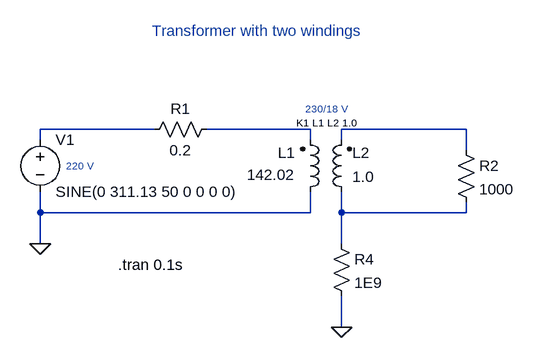
[diagram p0: schematic transformer.asc]
transformer.asc, the LTspice schematic file:
Version 4
SHEET 1 880 680
WIRE -128 176 -304 176
WIRE 112 176 -48 176
WIRE 352 176 160 176
WIRE -304 192 -304 176
WIRE 112 192 112 176
WIRE 160 192 160 176
WIRE 352 208 352 176
WIRE -304 304 -304 272
WIRE 112 304 112 272
WIRE 112 304 -304 304
WIRE 160 304 160 272
WIRE 352 304 352 288
WIRE 352 304 160 304
WIRE -304 352 -304 304
WIRE 160 352 160 304
WIRE 160 480 160 432
FLAG 160 480 0
FLAG -304 352 0
SYMBOL ind2 96 288 M180
WINDOW 0 -7 76 Right 2
WINDOW 3 -7 42 Right 2
SYMATTR InstName L1
SYMATTR Value 142.02
SYMATTR Type ind
SYMBOL voltage -304 176 R0
WINDOW 123 0 0 Left 2
WINDOW 39 0 0 Left 2
SYMATTR InstName V1
SYMATTR Value SINE(0 311.13 50 0 0 0 0)
SYMBOL res -32 160 R90
WINDOW 0 0 56 VBottom 2
WINDOW 3 32 56 VTop 2
SYMATTR InstName R1
SYMATTR Value 0.2
SYMBOL res 336 192 R0
SYMATTR InstName R2
SYMATTR Value 1000
SYMBOL ind2 176 288 R180
WINDOW 0 -1 76 Right 2
WINDOW 3 -1 39 Right 2
SYMATTR InstName L2
SYMATTR Value 1.0
SYMATTR Type ind
SYMBOL res 144 336 R0
SYMATTR InstName R4
SYMATTR Value 1E9
TEXT 136 176 Bottom 1 !K1 L1 L2 1.0
TEXT -184 384 Left 2 !.tran 0.1s
TEXT 32 40 Bottom 2 ;Transformer with two windings
TEXT 104 144 Left 1 ;230/18 V
TEXT -264 232 Left 1 ;220 V

The netlist it stands for:
* transformer.asc
L1 0 N002 142.02
V1 N001 0 SINE(0 311.13 50 0 0 0 0)
R1 N002 N001 0.2
R2 N003 N004 1000
L2 N004 N003 1.0
R4 N004 0 1E9
K1 L1 L2 1.0
.tran 0.1s
* Transformer with two windings
* 230/18 V
* 220 V
.backanno
.end